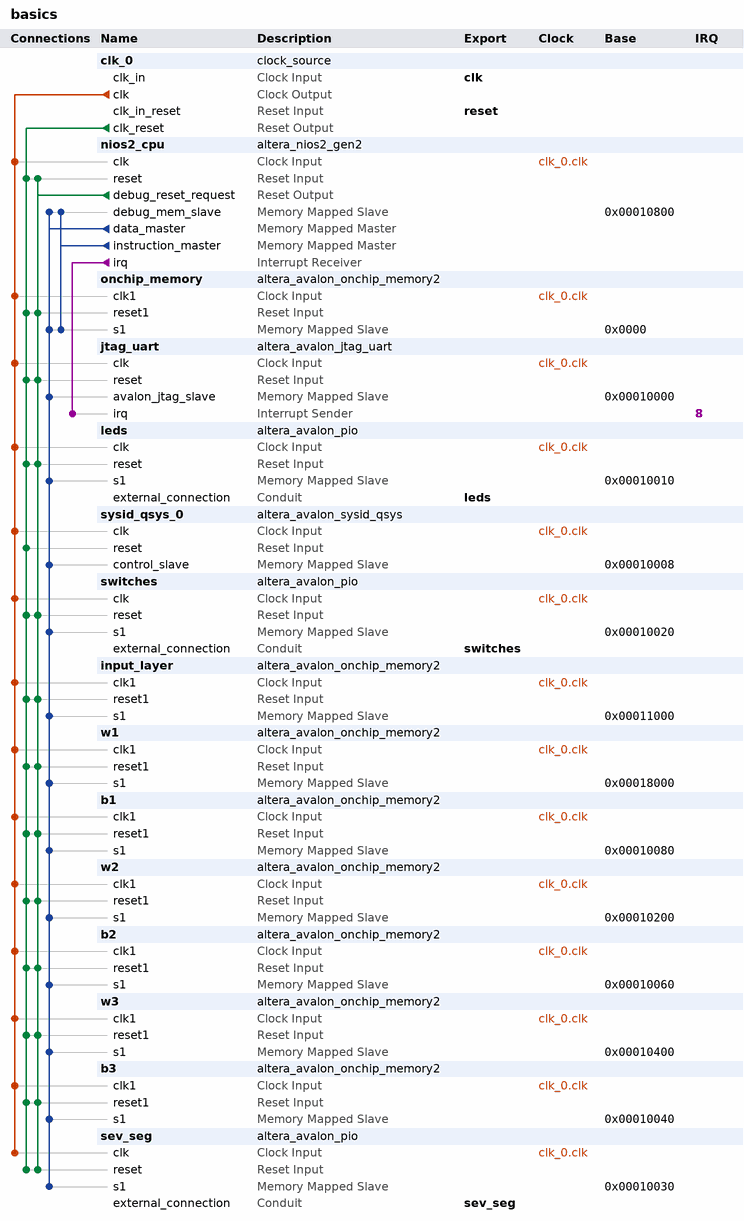
[diagram p0: system contents]
# Platform Designer (Qsys) system basics, Cyclone V 5CSEMA5F31C6
# Parameters at their usual value, and those the tool derives, are not listed.
package require -exact qsys 18.1
create_system basics
set_project_property DEVICE_FAMILY {Cyclone V}
set_project_property DEVICE 5CSEMA5F31C6

add_instance clk_0 clock_source 18.1
set_instance_parameter_value clk_0 clockFrequency 50000000

add_instance nios2_cpu altera_nios2_gen2 18.1
set_instance_parameter_value nios2_cpu dcache_size 2048
set_instance_parameter_value nios2_cpu exceptionSlave onchip_memory.s1
set_instance_parameter_value nios2_cpu icache_size 4096
set_instance_parameter_value nios2_cpu impl Tiny
set_instance_parameter_value nios2_cpu resetSlave onchip_memory.s1

add_instance onchip_memory altera_avalon_onchip_memory2 18.1
set_instance_parameter_value onchip_memory dataWidth 32
set_instance_parameter_value onchip_memory dualPort false
set_instance_parameter_value onchip_memory initMemContent false
set_instance_parameter_value onchip_memory initializationFileName onchip_mem.hex
set_instance_parameter_value onchip_memory memorySize 65536

add_instance jtag_uart altera_avalon_jtag_uart 18.1
set_instance_parameter_value jtag_uart simInteractiveOptions NO_INTERACTIVE_WINDOWS

add_instance leds altera_avalon_pio 18.1
set_instance_parameter_value leds direction Output
set_instance_parameter_value leds width 10

add_instance sysid_qsys_0 altera_avalon_sysid_qsys 18.1
set_instance_parameter_value sysid_qsys_0 id 4112

add_instance switches altera_avalon_pio 18.1
set_instance_parameter_value switches direction Input
set_instance_parameter_value switches width 10

add_instance input_layer altera_avalon_onchip_memory2 18.1
set_instance_parameter_value input_layer blockType M10K
set_instance_parameter_value input_layer dataWidth 16
set_instance_parameter_value input_layer dualPort false
set_instance_parameter_value input_layer initMemContent true
set_instance_parameter_value input_layer initializationFileName C:/Users/ahmad/PersonalProjects/NeuralNetwork/testing/test_image.mif
set_instance_parameter_value input_layer memorySize 1568
set_instance_parameter_value input_layer useNonDefaultInitFile true
set_instance_parameter_value input_layer writable false

add_instance w1 altera_avalon_onchip_memory2 18.1
set_instance_parameter_value w1 dataWidth 16
set_instance_parameter_value w1 dualPort false
set_instance_parameter_value w1 initMemContent true
set_instance_parameter_value w1 initializationFileName C:/Users/ahmad/PersonalProjects/NeuralNetwork/weights_biases/w1.mif
set_instance_parameter_value w1 memorySize 25088
set_instance_parameter_value w1 useNonDefaultInitFile true
set_instance_parameter_value w1 writable false

add_instance b1 altera_avalon_onchip_memory2 18.1
set_instance_parameter_value b1 dataWidth 16
set_instance_parameter_value b1 dualPort false
set_instance_parameter_value b1 initMemContent true
set_instance_parameter_value b1 initializationFileName C:/Users/ahmad/PersonalProjects/NeuralNetwork/weights_biases/b1.mif
set_instance_parameter_value b1 memorySize 32
set_instance_parameter_value b1 useNonDefaultInitFile true
set_instance_parameter_value b1 writable false

add_instance w2 altera_avalon_onchip_memory2 18.1
set_instance_parameter_value w2 dataWidth 16
set_instance_parameter_value w2 dualPort false
set_instance_parameter_value w2 initMemContent true
set_instance_parameter_value w2 initializationFileName C:/Users/ahmad/PersonalProjects/NeuralNetwork/weights_biases/w2.mif
set_instance_parameter_value w2 memorySize 512
set_instance_parameter_value w2 useNonDefaultInitFile true
set_instance_parameter_value w2 writable false

add_instance b2 altera_avalon_onchip_memory2 18.1
set_instance_parameter_value b2 dataWidth 16
set_instance_parameter_value b2 dualPort false
set_instance_parameter_value b2 initMemContent true
set_instance_parameter_value b2 initializationFileName C:/Users/ahmad/PersonalProjects/NeuralNetwork/weights_biases/b2.mif
set_instance_parameter_value b2 memorySize 32
set_instance_parameter_value b2 useNonDefaultInitFile true
set_instance_parameter_value b2 writable false

add_instance w3 altera_avalon_onchip_memory2 18.1
set_instance_parameter_value w3 dataWidth 16
set_instance_parameter_value w3 dualPort false
set_instance_parameter_value w3 initMemContent true
set_instance_parameter_value w3 initializationFileName C:/Users/ahmad/PersonalProjects/NeuralNetwork/weights_biases/w3.mif
set_instance_parameter_value w3 memorySize 320
set_instance_parameter_value w3 useNonDefaultInitFile true
set_instance_parameter_value w3 writable false

add_instance b3 altera_avalon_onchip_memory2 18.1
set_instance_parameter_value b3 dataWidth 16
set_instance_parameter_value b3 dualPort false
set_instance_parameter_value b3 initMemContent true
set_instance_parameter_value b3 initializationFileName C:/Users/ahmad/PersonalProjects/NeuralNetwork/weights_biases/b3.mif
set_instance_parameter_value b3 memorySize 32
set_instance_parameter_value b3 useNonDefaultInitFile true
set_instance_parameter_value b3 writable false

add_instance sev_seg altera_avalon_pio 18.1
set_instance_parameter_value sev_seg direction Output
set_instance_parameter_value sev_seg width 7

# connections
add_connection clk_0.clk b1.clk1 clock
add_connection clk_0.clk b2.clk1 clock
add_connection clk_0.clk b3.clk1 clock
add_connection clk_0.clk input_layer.clk1 clock
add_connection clk_0.clk jtag_uart.clk clock
add_connection clk_0.clk leds.clk clock
add_connection clk_0.clk nios2_cpu.clk clock
add_connection clk_0.clk onchip_memory.clk1 clock
add_connection clk_0.clk sev_seg.clk clock
add_connection clk_0.clk switches.clk clock
add_connection clk_0.clk sysid_qsys_0.clk clock
add_connection clk_0.clk w1.clk1 clock
add_connection clk_0.clk w2.clk1 clock
add_connection clk_0.clk w3.clk1 clock
add_connection clk_0.clk_reset b1.reset1 reset
add_connection clk_0.clk_reset b2.reset1 reset
add_connection clk_0.clk_reset b3.reset1 reset
add_connection clk_0.clk_reset input_layer.reset1 reset
add_connection clk_0.clk_reset jtag_uart.reset reset
add_connection clk_0.clk_reset leds.reset reset
add_connection clk_0.clk_reset nios2_cpu.reset reset
add_connection clk_0.clk_reset onchip_memory.reset1 reset
add_connection clk_0.clk_reset sev_seg.reset reset
add_connection clk_0.clk_reset switches.reset reset
add_connection clk_0.clk_reset sysid_qsys_0.reset reset
add_connection clk_0.clk_reset w1.reset1 reset
add_connection clk_0.clk_reset w2.reset1 reset
add_connection clk_0.clk_reset w3.reset1 reset
add_connection nios2_cpu.debug_reset_request b1.reset1 reset
add_connection nios2_cpu.debug_reset_request b2.reset1 reset
add_connection nios2_cpu.debug_reset_request b3.reset1 reset
add_connection nios2_cpu.debug_reset_request input_layer.reset1 reset
add_connection nios2_cpu.debug_reset_request jtag_uart.reset reset
add_connection nios2_cpu.debug_reset_request leds.reset reset
add_connection nios2_cpu.debug_reset_request nios2_cpu.reset reset
add_connection nios2_cpu.debug_reset_request onchip_memory.reset1 reset
add_connection nios2_cpu.debug_reset_request sev_seg.reset reset
add_connection nios2_cpu.debug_reset_request switches.reset reset
add_connection nios2_cpu.debug_reset_request w1.reset1 reset
add_connection nios2_cpu.debug_reset_request w2.reset1 reset
add_connection nios2_cpu.debug_reset_request w3.reset1 reset
add_connection nios2_cpu.data_master b1.s1 avalon
set_connection_parameter_value nios2_cpu.data_master/b1.s1 baseAddress 0x00010080
add_connection nios2_cpu.data_master b2.s1 avalon
set_connection_parameter_value nios2_cpu.data_master/b2.s1 baseAddress 0x00010060
add_connection nios2_cpu.data_master b3.s1 avalon
set_connection_parameter_value nios2_cpu.data_master/b3.s1 baseAddress 0x00010040
add_connection nios2_cpu.data_master input_layer.s1 avalon
set_connection_parameter_value nios2_cpu.data_master/input_layer.s1 baseAddress 0x00011000
add_connection nios2_cpu.data_master jtag_uart.avalon_jtag_slave avalon
set_connection_parameter_value nios2_cpu.data_master/jtag_uart.avalon_jtag_slave baseAddress 0x00010000
add_connection nios2_cpu.data_master leds.s1 avalon
set_connection_parameter_value nios2_cpu.data_master/leds.s1 baseAddress 0x00010010
add_connection nios2_cpu.data_master nios2_cpu.debug_mem_slave avalon
set_connection_parameter_value nios2_cpu.data_master/nios2_cpu.debug_mem_slave baseAddress 0x00010800
add_connection nios2_cpu.data_master onchip_memory.s1 avalon
set_connection_parameter_value nios2_cpu.data_master/onchip_memory.s1 baseAddress 0x0000
add_connection nios2_cpu.data_master sev_seg.s1 avalon
set_connection_parameter_value nios2_cpu.data_master/sev_seg.s1 baseAddress 0x00010030
add_connection nios2_cpu.data_master switches.s1 avalon
set_connection_parameter_value nios2_cpu.data_master/switches.s1 baseAddress 0x00010020
add_connection nios2_cpu.data_master sysid_qsys_0.control_slave avalon
set_connection_parameter_value nios2_cpu.data_master/sysid_qsys_0.control_slave baseAddress 0x00010008
add_connection nios2_cpu.data_master w1.s1 avalon
set_connection_parameter_value nios2_cpu.data_master/w1.s1 baseAddress 0x00018000
add_connection nios2_cpu.data_master w2.s1 avalon
set_connection_parameter_value nios2_cpu.data_master/w2.s1 baseAddress 0x00010200
add_connection nios2_cpu.data_master w3.s1 avalon
set_connection_parameter_value nios2_cpu.data_master/w3.s1 baseAddress 0x00010400
add_connection nios2_cpu.instruction_master nios2_cpu.debug_mem_slave avalon
set_connection_parameter_value nios2_cpu.instruction_master/nios2_cpu.debug_mem_slave baseAddress 0x00010800
add_connection nios2_cpu.instruction_master onchip_memory.s1 avalon
set_connection_parameter_value nios2_cpu.instruction_master/onchip_memory.s1 baseAddress 0x0000
add_connection nios2_cpu.irq jtag_uart.irq interrupt
set_connection_parameter_value nios2_cpu.irq/jtag_uart.irq irqNumber 8

# exported interfaces
add_interface clk clock sink
set_interface_property clk EXPORT_OF clk_0.clk_in
add_interface leds conduit end
set_interface_property leds EXPORT_OF leds.external_connection
add_interface reset reset sink
set_interface_property reset EXPORT_OF clk_0.clk_in_reset
add_interface sev_seg conduit end
set_interface_property sev_seg EXPORT_OF sev_seg.external_connection
add_interface switches conduit end
set_interface_property switches EXPORT_OF switches.external_connection

set_interconnect_requirement {$system} qsys_mm.clockCrossingAdapter HANDSHAKE
set_interconnect_requirement {$system} qsys_mm.enableEccProtection FALSE
set_interconnect_requirement {$system} qsys_mm.insertDefaultSlave FALSE
set_interconnect_requirement {$system} qsys_mm.maxAdditionalLatency 1

save_system basics.qsys
